# Altium schematic sheet power.SchDoc: Power
size 209 x 148 mm; Revision: 1.0.0; SheetNumber: 8; SheetTotal: 10
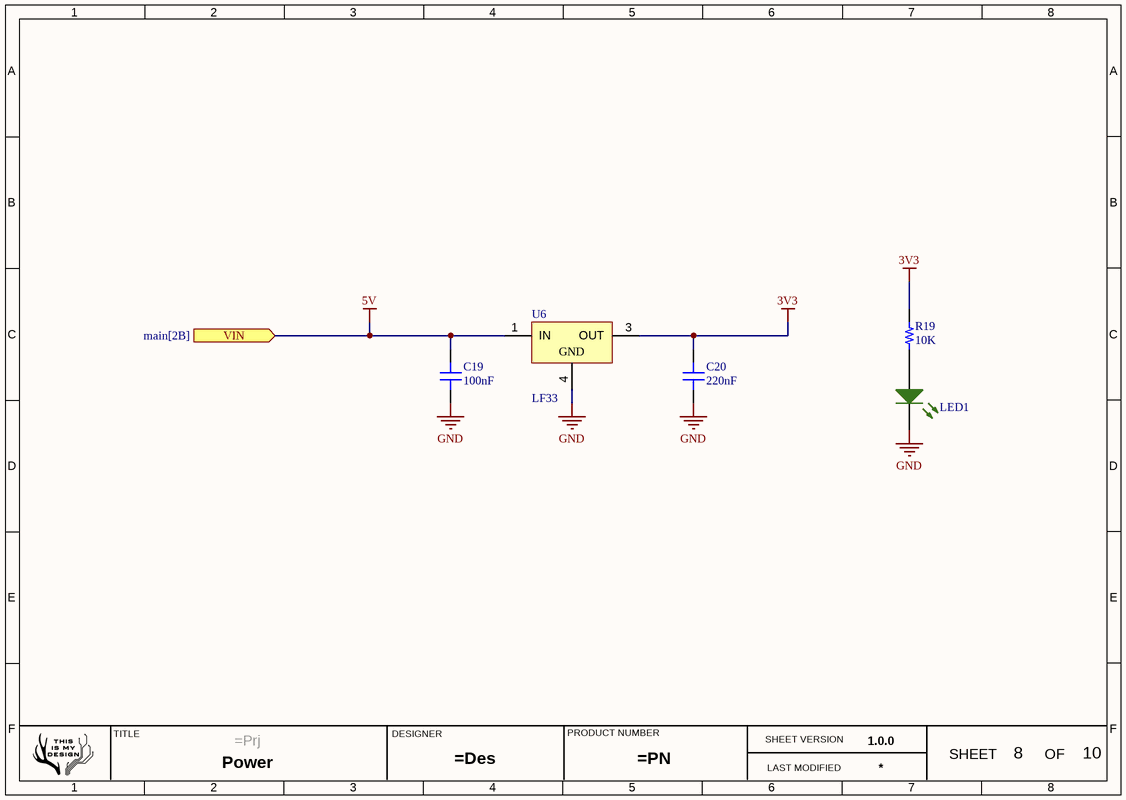
[diagram p0: power.SchDoc]

## Parts
C19  100nF  [CAP 0603_1608]
C20  220nF  [CAP 0603_1608]
LED1  LED SMD 0603 GREEN  [LED_0603_GREEN]  (value not drawn)
R19  10K  [RES 0603_1608]
U6  LF33  [TO-252]

## Ports
VIN (in, see main[2B])

## Nets
3V3: C20.2 R19.1 U6.3(OUT)
5V: C19.2 U6.1(IN) ; port VIN
GND: C19.1 C20.1 LED1.2(K) U6.4(GND)
NetLED1_1: LED1.1(A) R19.2

## Notes on the sheet
- TITLE
- DESIGNER
- PRODUCT NUMBER
- SHEET VERSION
- SHEET
- OF
- LAST MODIFIED

## Library data of the parts
C19 C20 = Cap 0603: SMT Capacitor
  C19: VALUE: 100nF
  C20: VALUE: 220nF
R19 = Res 0603: SMT Resistor; VALUE: 10K
U6 = LF33 (SMD): 500mA, Very Low Drop (0.45V) Voltage Regulator, 3.3V, 3-Pin DPAK, Tape and Reel; PartNumber: LF33CDT-TR; DatasheetVersion: Nov-2010; PackageVersion: 2011; PackageReference: TO-252; PackageDescription: 3-Pin Transistor Outline Package 2.28 mm Pitch, 9.7 mm Lead Span (DPAK); ComponentLink1Description: Manufacturer URL; ComponentLink1URL: http://www.st.com; ComponentLink2Description: Datasheet; ComponentLink2URL: http://www.st.com/internet/com/TECHNICAL_RESOURCES/TECHNICAL_LITERATURE/DATASHEET/CD00000546.pdf